# EAGLE design teensy_protocol_xl8r_3_2 (EAGLE 8.5.2)
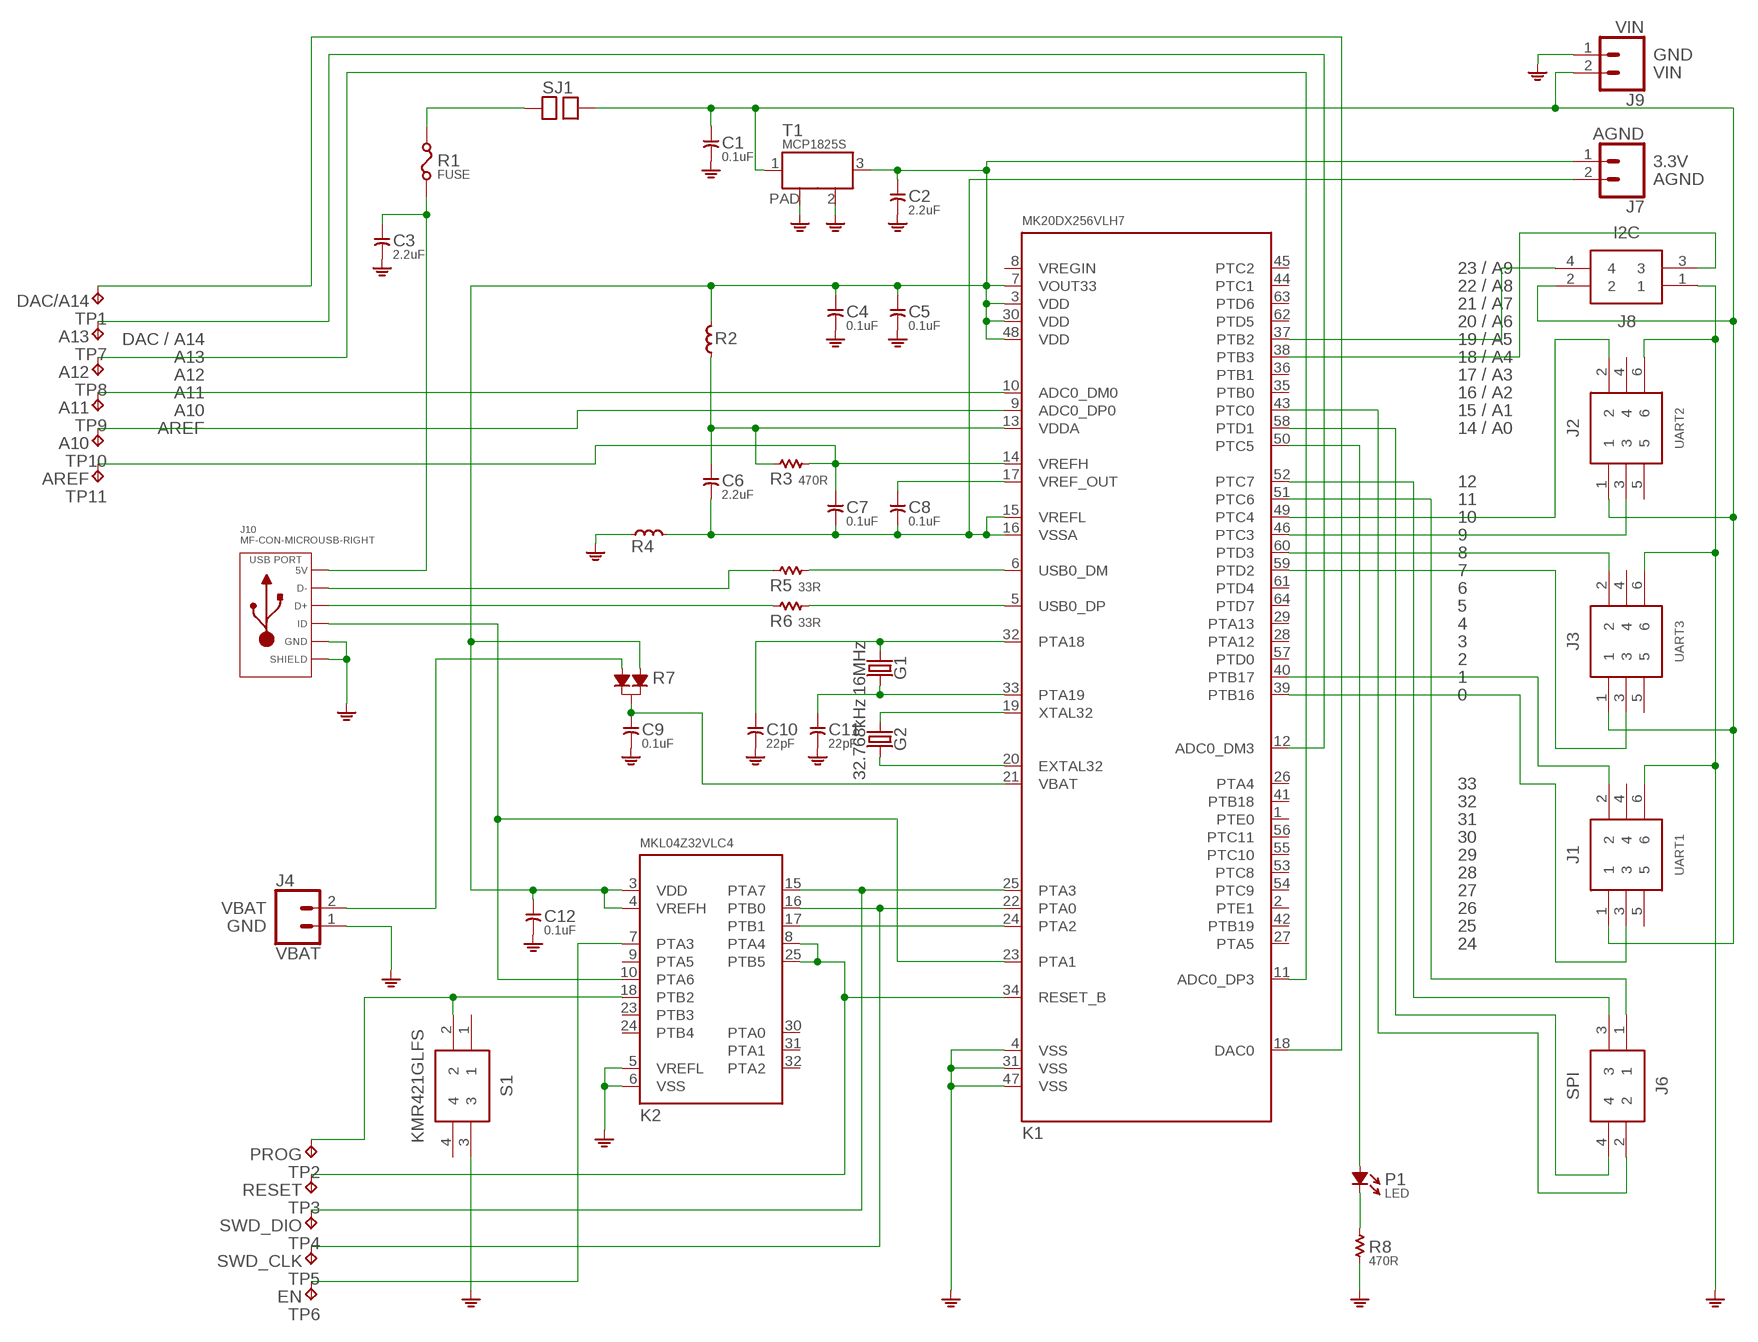
[diagram p0: schematic, sheet 1]

## Parts
C1  0.1uF  CAPACITOR-0.1UF  [C0603]
C2  2.2uF  CAPACITOR-2.2UF  [C0805]
C3  2.2uF  CAPACITOR-2.2UF  [C0805]
C4  0.1uF  CAPACITOR-0.1UF  [C0603]
C5  0.1uF  CAPACITOR-0.1UF  [C0603]
C6  2.2uF  CAPACITOR-2.2UF  [C0805]
C7  0.1uF  CAPACITOR-0.1UF  [C0603]
C8  0.1uF  CAPACITOR-0.1UF  [C0603]
C9  0.1uF  CAPACITOR-0.1UF  [C0603]
C10  22pF  CAPACITOR-22PF  [C0603]
C11  22pF  CAPACITOR-22PF  [C0603]
C12  0.1uF  CAPACITOR-0.1UF  [C0603]
G1  16MHz  CRYSTAL-16MHZSMD-5X3.2  [CRYSTAL-SMD-5X3.2-4PAD]
G2  32.768kHz  CRYSTAL-32.768KHZSMD-3.2X1.5  [CRYSTAL-SMD-3.2X1.5MM]
J1  UART1  BM06B-GHS-TBT(LF)(SN)  [BM06B-GHS-TBT]
J2  UART2  BM06B-GHS-TBT(LF)(SN)  [BM06B-GHS-TBT]
J3  UART3  BM06B-GHS-TBT(LF)(SN)  [BM06B-GHS-TBT]
J4  VBAT  CONN_02  [1X02]
J6  SPI  BM04B-GHS-TBT(LF)(SN)  [BM04B-GHS-TBT]
J7  AGND  CONN_02  [1X02]
J8  I2C  BM04B-GHS-TBT(LF)(SN)  [BM04B-GHS-TBT]
J9  VIN  CONN_02  [1X02]
J10  MF-CON-MICROUSB-RIGHT  USB_MICRO_RIGHT  [MICROUSB-RIGHT]
K1  MK20DX256VLH7  [LQFP64-05]
K2  MKL04Z32VLC4  [LQFP32-08]
P1  LED  [LED-0805]
R1  FUSE  [F0805]
R2  FERRITE  [L0603]
R3  470R  RESISTOR-470R  [R0603]
R4  FERRITE  [L0603]
R5  33R  RESISTOR-33R  [R0603]
R6  33R  RESISTOR-33R  [R0603]
R7  DIODE_DUAL  [SOT-23]
R8  470R  RESISTOR-470R  [R0603]
S1  KMR421GLFS  [KMR_2]
SJ1  VUSB  SOLDERJUMPER  [SOLDERJUMPER]
T1  MCP1825S  LDO  [SOT-223]
TP1  TPTP06R  [TP06R]
TP2  TPTP06R  [TP06R]
TP3  TPTP06R  [TP06R]
TP4  TPTP06R  [TP06R]
TP5  TPTP06R  [TP06R]
TP6  TPTP06R  [TP06R]
TP7  TPTP06R  [TP06R]
TP8  TPTP06R  [TP06R]
TP9  TPTP06R  [TP06R]
TP10  TPTP06R  [TP06R]
TP11  TPTP06R  [TP06R]

## Nets
CS: J6.2 K1.43(PTC0)
DIN: J6.3 K1.52(PTC7)
DOUT: J6.1 K1.51(PTC6)
GND [GND]: C1.2 C2.2 C3.2 C4.2 C5.2 C9.2 C10.2 C11.2 C12.2 J1.6 J2.6 J3.6 J4.1 J8.1 J9.1 J10.5(GND) J10.S1(SLD) J10.S2(SLD) J10.S3(SLD) J10.S4(SLD) J10.S5(SLD) J10.S6(SLD) K1.4(VSS) K1.31(VSS) K1.47(VSS) K2.5(VREFL) K2.6(VSS) R4.1 R8.1 S1.3 T1.2(GND) T1.PAD
N$1: K2.7(PTA3) TP6.TP
N$2: K1.22(PTA0) K2.16(PTB0) TP5.TP
N$3: K1.24(PTA2) K2.17(PTB1)
N$5: C10.1 G1.1 K1.32(PTA18)
N$6: C11.1 G1.3 K1.33(PTA19)
N$7: G2.P$1 K1.19(XTAL32)
N$8: G2.P$2 K1.20(EXTAL32)
N$9: K2.18(PTB2) S1.2 TP2.TP
N$10: K1.5(USB0_DP) R6.2
N$11: C8.1 K1.17(VREF_OUT)
N$12: K1.34(RESET_B) K2.8(PTA4) K2.25(PTB5) TP3.TP
N$13: C7.1 K1.14(VREFH) R3.2 TP11.TP
N$14: K1.6(USB0_DM) R5.2
N$15: C6.1 K1.13(VDDA) R2.1 R3.1
N$25: J8.4 K1.37(PTB2)
N$26: J8.3 K1.38(PTB3)
N$31: K1.50(PTC5) P1.+
N$34: J2.2 K1.49(PTC4)
N$35: J2.3 K1.46(PTC3)
N$36: J3.2 K1.60(PTD3)
N$37: J3.3 K1.59(PTD2)
N$43: J1.2 K1.40(PTB17)
N$44: J1.3 K1.39(PTB16)
N$45: K1.12(ADC0_DM3) TP7.TP
N$52: P1.- R8.2
N$53: C6.2 C7.2 C8.2 J7.2 K1.15(VREFL) K1.16(VSSA) R4.2
N$54: K1.18(DAC0) TP1.TP
N$55: K1.11(ADC0_DP3) TP8.TP
N$63: J4.2 R7.2
N$64: K1.10(ADC0_DM0) TP9.TP
N$65: K1.9(ADC0_DP0) TP10.TP
N$67: R1.2 SJ1.1
N$68: C9.1 K1.21(VBAT) R7.3
N$69: C2.1 C4.1 C5.1 C12.1 J7.1 K1.3(VDD) K1.7(VOUT33) K1.30(VDD) K1.48(VDD) K2.3(VDD) K2.4(VREFH) R2.2 R7.1 T1.3(OUT)
N$70: K1.25(PTA3) K2.15(PTA7) TP4.TP
SCK: J6.4 K1.58(PTD1)
USB0_DM: J10.2(D-) R5.1
USB0_DP: J10.3(D+) R6.1
USB0_ID: J10.4(ID) K1.23(PTA1) K2.10(PTA6)
VBUS: C3.1 J10.1(5V) R1.1
VIN [VIN]: C1.1 J1.1 J2.1 J3.1 J8.2 J9.2 SJ1.2 T1.1(IN)
Unconnected: J1.4 J1.5 J2.4 J2.5 J3.4 J3.5 K1.1(PTE0) K1.2(PTE1) K1.8(VREGIN) K1.26(PTA4) K1.27(PTA5) K1.28(PTA12) K1.29(PTA13) K1.35(PTB0) K1.36(PTB1) K1.41(PTB18) K1.42(PTB19) K1.44(PTC1) K1.45(PTC2) K1.53(PTC8) K1.54(PTC9) K1.55(PTC10) K1.56(PTC11) K1.57(PTD0) K1.61(PTD4) K1.62(PTD5) K1.63(PTD6) K1.64(PTD7) K2.9(PTA5) K2.23(PTB3) K2.24(PTB4) K2.30(PTA0) K2.31(PTA1) K2.32(PTA2) S1.1 S1.4

## Notes on the sheet
- GND
- VIN
- 3.3V
- AGND
- 23 / A9
- 22 / A8
- 21 / A7
- 20 / A6
- DAC / A14 | 19 / A5
- A13 | 18 / A4
- A12 | 17 / A3
- A11 | 16 / A2
- A10 | 15 / A1
- AREF | 14 / A0
- 12
- 11
- 10
- 9
- 8
- 7
- 6
- 5
- 4
- 3
- 2
- 1
- 0
- 33
- 32
- 31
- 30
- 29
- 28
- 27
- VBAT | 26
- GND | 25
- 24

## Library data of the parts
C1 C4 C5 C7-C9 C12 = t32_ref:CAPACITOR-0.1UF; DESC: 0.1uF / 16VDC / X7R; MF: Murata Electronics; MPN: GRM188R71C104KA01D; OC_MOUSER: 81-GRM39X104K16; PACKAGE: 0603; TYPE: Capacitor
C2 C3 C6 = t32_ref:CAPACITOR-2.2UF; DESC: 2.2uF / 25 VDC / X7R; MF: Taiyo Yuden; MPN: TMK212B7225KG-TR; OC_MOUSER: 963-TMK212B7225KG-TR; PACKAGE: 0805; TYPE: Capacitor
C10 C11 = t32_ref:CAPACITOR-22PF; DESC: 22pF / 50VDC / C0G (NP0); MF: Vishay / Vitramon; MPN: VJ0603A220JXACW1BC; OC_MOUSER: 77-VJ0603A220JXACBC; PACKAGE: 0603; TYPE: Capacitor
G1 = SparkFun-Clocks:CRYSTAL-16MHZ: 16MHz Crystal Digikey Example <http://www.digikey.com/product-search/en?keywords=535-9122-1-ND> Frequency: 16MHz Frequency Stability: ±50ppm Frequency Tolerance: ±20ppm Load Capacitance: 18pF SparkFun Products: Pro Micro -5V/16MHz <https://www.sparkfun.com/products/12640> SparkFun Serial Enabled LCD Kit <https://www.sparkfun.com/products/10097>; PROD_ID: XTAL-08218; SF_ID: COM-00094
G2 = SparkFun-Clocks:CRYSTAL-32.768KHZ: 32.768kHz Crystal Frequency: 32.768kHz Frequency Stability: ±20ppm Load Capacitance: 12.5pF (PTH-2X6 & SMD-3.2X1.5), 6pF (SMD-2X6) SparkFun Products: SparkFun BigTime Watch Kit <https://www.sparkfun.com/products/11734> SparkFun nRF52832 Breakout <https://www.sparkfun.com/products/13990> SparkFun Real Time Clock Module <https://www.sparkfun.com/products/12708>; PROD_ID: XTAL-13062
J1-J3 = BM06B-GHS-TBT(LF)(SN):BM06B-GHS-TBT(LF)(SN): GH 1.25mm header top entry 6 way JST GH Series, 1.25mm Pitch 6 Way Shrouded Straight PCB Header, Surface Mount, Solder Termination <https://componentsearchengine.com/Images/3/BM06B-GHS-TBT%28LF%29%28SN%29.jpg> Source: Datasheet <http://docs-europe.electrocomponents.com/webdocs/10ce/0900766b810cef17.pdf>; DESCRIPTION: GH 1.25mm header top entry 6 way JST GH Series, 1.25mm Pitch 6 Way Shrouded Straight PCB Header, Surface Mount, Solder Termination; HEIGHT: mm; MANUFACTURER_NAME: JST (JAPAN SOLDERLESS TERMINALS); MANUFACTURER_PART_NUMBER: BM06B-GHS-TBT(LF)(SN); MPN: BM06B-GHS-TBT(LF)(SN); POPULATE: 1; RS_PART_NUMBER: 7521771; SUPPLIER_NAME: RS
J4 J7 J9 = SparkFun-Connectors:CONN_02: Multi connection point. Often used as Generic Header-pin footprint for 0.1 inch spaced/style header connections On any of the 0.1 inch spaced packages, you can populate with these: Break Away Headers - Straight <https://www.sparkfun.com/products/116> (PRT-00116) Break Away Male Headers - Right Angle <https://www.sparkfun.com/products/553> (PRT-00553) Female Headers <https://www.sparkfun.com/products/115> (PRT-00115) Break Away Headers - Machine Pin <https://www.sparkfun.com/products/117> (PRT-00117) Break Away Female Headers - Swiss Machine Pin <https://www.sparkfun.com/products/743> (PRT-00743) For SCREWTERMINALS and SPRING TERMINALS visit here: Screw Terimnals on SparkFun.com <https://www.sparkfun.com/search/results?term=Screw+Terminals> (5mm/3.5mm/2.54mm spacing) This device is also useful as a general connection point to wire up your design to another part of your project. Our various solder wires solder well into these plated through hole pads. Hook-Up Wire - Assortment (Stranded, 22 AWG) <https://www.sparkfun.com/products/11375> (PRT-11375) Hook-Up Wire - Assortment (Solid Core, 22 AWG) <https://www.sparkfun.com/products/11367> (PRT-11367) View the entire wire category on our website here <https://www.sparkfun.com/categories/141> Special notes: Molex polarized connector foot print use with: PRT-08233 with associated crimp pins and housings. 2.54_SCREWTERM for use with PRT-10571. 3.5mm Screw Terminal footprints for PRT-08084 5mm Screw Terminal footprints for use with PRT-08432
J6 J8 = BM04B-GHS-TBT(LF)(SN):BM04B-GHS-TBT(LF)(SN): JST GH Series, 1.25mm Pitch 4 Way Straight PCB Header, Solder Termination, 1A <https://componentsearchengine.com/Images/3/BM04B-GHS-TBT%28LF%29%28SN%29.jpg> Source: Datasheet <http://uk.rs-online.com/web/p/products/7521769>; DESCRIPTION: JST GH Series, 1.25mm Pitch 4 Way Straight PCB Header, Solder Termination, 1A; HEIGHT: mm; MANUFACTURER_NAME: JST (JAPAN SOLDERLESS TERMINALS); MANUFACTURER_PART_NUMBER: BM04B-GHS-TBT(LF)(SN); MPN: BM04B-GHS-TBT(LF)(SN); POPULATE: 1; RS_PART_NUMBER: 7521769P; SUPPLIER_NAME: RS
J10 = MF_Connectors:USB: Library: MF_Connectors Description: 5 Pin USB Connectors. SLD is the shield connection. Usually tied to ground through a small ferrite bead.; HOUSEPART: YES; MPN: MF-CON-MICROUSB-RIGHT; POPULATE: 1; URL: https://factory.macrofab.com/part/MF-CON-MICROUSB-RIGHT
K1 = t32_ref:MK20DX256VLH7; DESC: MK20DX256VLH7; MF: NXP; MPN: MK20DX256VLH7; OC_MOUSER: 841-MK20DX256VLH7; PACKAGE: LQFP-64; TYPE: Microcontroller
K2 = t32_ref:MKL04Z32VLC4; DESC: MKL04Z32VLC4 (preprogrammed); MF: PJRC; MPN: IC_MKL04Z32_TQFP32; PACKAGE: LQFP-32; TYPE: Microcontroller
P1 = t32_ref:LED; DESC: orange; MF: ROHM Semiconductor; MPN: SML-211DTT86; OC_MOUSER: 755-SML-211DTT86; PACKAGE: 0805; TYPE: LED
R1 = t32_ref:FUSE; DESC: 6V / 0.5A; MF: Bel Fuse; MPN: 0ZCK0050FF2E; OC_MOUSER: 530-0ZCK0050FF2E; PACKAGE: 0805; TYPE: PPTC
R2 R4 = t32_ref:FERRITE; DESC: 600R / 100MHz; MF: Murata Electronics; MPN: BLM18AG601SN1D; OC_MOUSER: 81-BLM11A601S; PACKAGE: 0603; TYPE: Ferrite
R3 R8 = t32_ref:RESISTOR-470R; DESC: 470R / 1 % / 0.1 W; MF: Vishay; MPN: CRCW0603470RFKEA; OC_MOUSER: 71-CRCW0603-470-E3; PACKAGE: 0603; TYPE: Resistor
R5 R6 = t32_ref:RESISTOR-33R; DESC: 33R / 1% / 0.25 W; MF: Panasonic; MPN: ERJ-PA3F33R0V; OC_MOUSER: 667-ERJ-PA3F33R0V; PACKAGE: 0603; TYPE: Resistor
R7 = t32_ref:DIODE_DUAL; DESC: Dual Schottky, common cat; MF: NXP Semiconductors; MPN: BAT54C,215; OC_MOUSER: 771-BAT54C-T/R; PACKAGE: SOT-23; TYPE: Diode
S1 = KMR421GLFS:KMR421GLFS: C & K COMPONENTS - KMR421GLFS - SWITCH, GROUND, 2N <https://componentsearchengine.com/Images/1/KMR421GLFS.jpg> Source: Datasheet <http://www.farnell.com/datasheets/1443639.pdf>; DESCRIPTION: C & K COMPONENTS - KMR421GLFS - SWITCH, GROUND, 2N; HEIGHT: mm; MANUFACTURER_NAME: C & K COMPONENTS; MANUFACTURER_PART_NUMBER: KMR421GLFS; SUPPLIER_NAME: RS
SJ1 = t32_ref:SOLDERJUMPER
T1 = t32_ref:LDO; DESC: 3.3V 500mA; MF: Microchip Technology; MPN: MCP1825S-3302E/DB; OC_MOUSER: 579-MCP1825S-3302EDB; PACKAGE: SOT-223-3; TYPE: Voltage regulator
TP1 = testpad:TP: Test pad; TP_SIGNAL_NAME: DAC/A14
TP2 = testpad:TP: Test pad; TP_SIGNAL_NAME: PROG
TP3 = testpad:TP: Test pad; TP_SIGNAL_NAME: RESET
TP4 = testpad:TP: Test pad; TP_SIGNAL_NAME: SWD_DIO
TP5 = testpad:TP: Test pad; TP_SIGNAL_NAME: SWD_CLK
TP6 = testpad:TP: Test pad; TP_SIGNAL_NAME: EN
TP7 = testpad:TP: Test pad; TP_SIGNAL_NAME: A13
TP8 = testpad:TP: Test pad; TP_SIGNAL_NAME: A12
TP9 = testpad:TP: Test pad; TP_SIGNAL_NAME: A11
TP10 = testpad:TP: Test pad; TP_SIGNAL_NAME: A10
TP11 = testpad:TP: Test pad; TP_SIGNAL_NAME: AREF

## Net classes
0 default: width 0.202 mm
1 GND: width 0.405 mm
2 VIN: width 0.303 mm

## Board
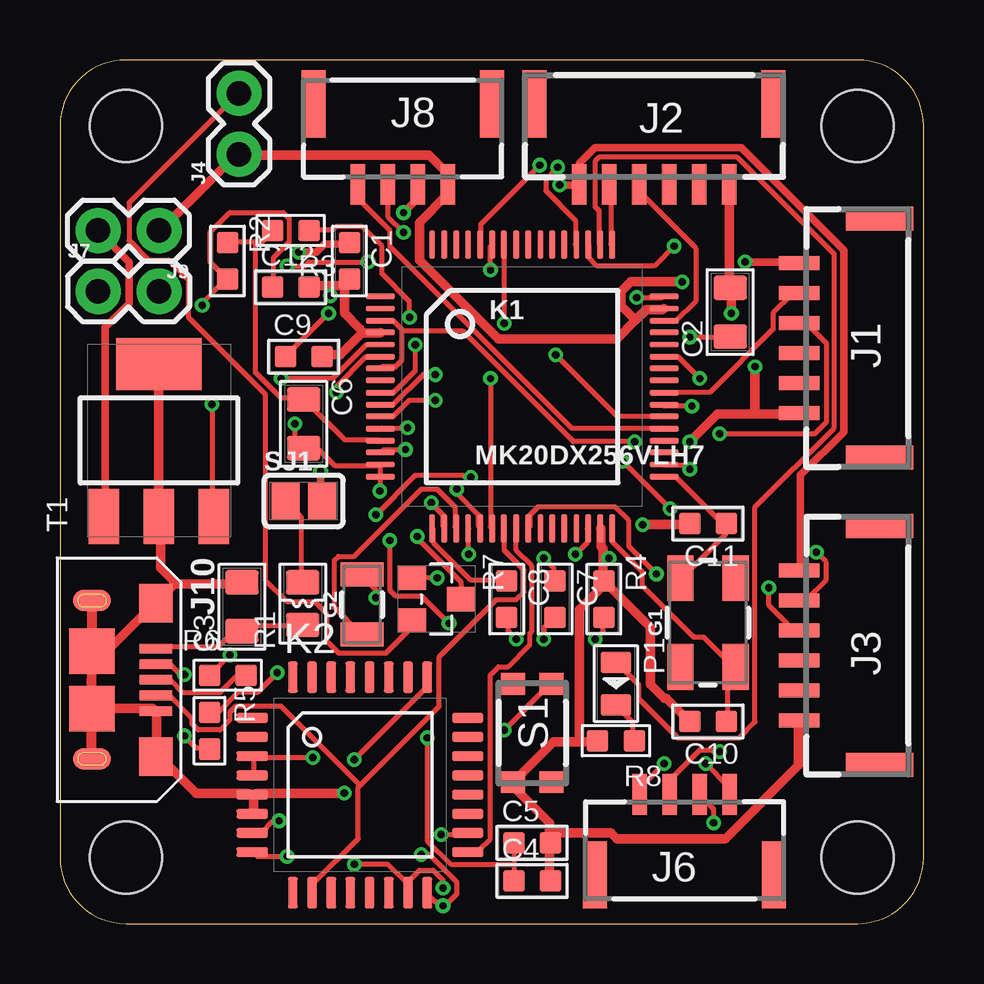
[diagram p1: board, top side]
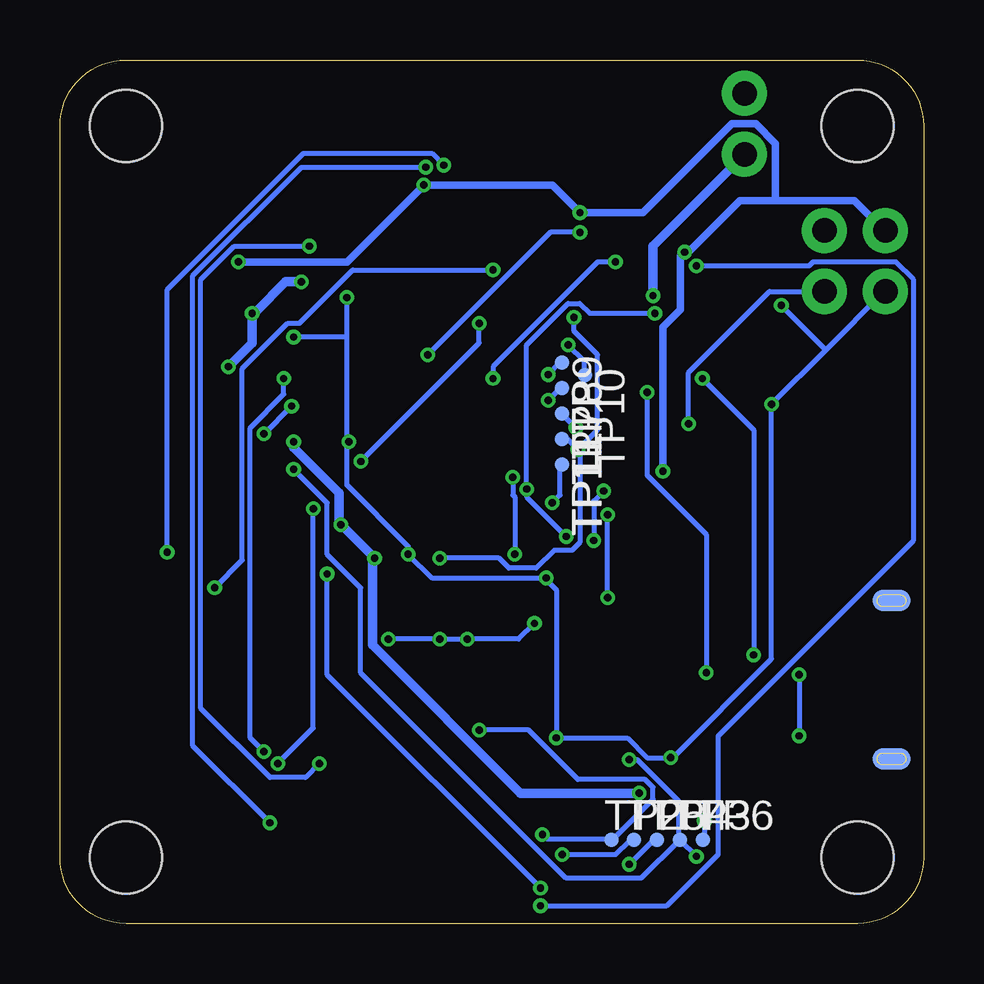
[diagram p2: board, bottom side, seen from below]

Size 36 x 36 mm. Coordinates in mm from the lower left corner, seen from the top.
Outline: 0,33.25 0,2.75 arc90 2.75,0 33.25,0 arc90 36,2.75 36,33.25 arc90 33.25,36 2.75,36 arc90 0,33.25
Copper layers (1*16): Top 0.035mm / dielectric 1.5mm / Bottom 0.035mm
Design rules "MF_Standard_2_Layer": minimum track width 5mil, minimum drill 12mil, track to track 5mil, track to pad 5mil, pad to pad 5mil, via to via 5mil, smd to smd 0mil, copper to edge 10mil, drill to drill 10mil, minimum pad ring 6mil, minimum via ring 6mil, stop-mask expansion 2mil, vias tented up to drill 25mil, thermal gap 10mil
Holes 3 mm at 2.75,2.75 2.75,33.25 33.25,33.25 33.25,2.75
tKeepout: area 0,0 to 5.2,5.2; area 0,30.8 to 5.2,36; area 30.8,30.8 to 36,36; area 30.8,0 to 36,5.2

### Footprints (pad centres in the part's own frame; a part is rotated, then mirrored left to right if it is on the bottom)
C0603 = smd 0.889 x 0.889: 1 0,0.762; 2 0,-0.762
C0805 = smd 1.397 x 1.016: 1 0,1.016; 2 0,-1.016
CRYSTAL-SMD-5X3.2-4PAD = smd 1.9 x 1.1: 1 -1.85,-1.15; 2 1.85,-1.15; 3 1.85,1.15; 4 -1.85,1.15
CRYSTAL-SMD-3.2X1.5MM = smd 1 x 1.8: P$1 -1.25,0; P$2 1.25,0
BM06B-GHS-TBT = smd 0.6 x 1.7: 1 3.125,0.3; 2 1.875,0.3; 3 0.625,0.3; 4 -0.625,0.3; 5 -1.875,0.3; 6 -3.125,0.3 | smd 1 x 2.8: 7 4.975,-3.05; 8 -4.975,-3.05
1X02 = drill 1.016 pad 1.88: 1 0,0; 2 2.54,0
BM04B-GHS-TBT = smd 0.6 x 1.7: 1 -1.875,0.3; 2 -0.625,0.3; 3 0.625,0.3; 4 1.875,0.3 | smd 1 x 2.8: 5 -3.725,-3.05; 6 3.725,-3.05
MICROUSB-RIGHT = smd 0.4 x 1.35: 1 -1.3,1.27; 2 -0.65,1.27; 3 0,1.27; 4 0.65,1.27; 5 1.3,1.27 | smd 0.9 x 1.6: S1 -3.3,-1.4; S2 3.3,-1.4 | smd 1.6 x 1.4: S3 -3.2,1.27; S4 3.2,1.27 | smd 1.9 x 1.9: S5 -1.2,-1.405; S6 1.2,-1.405 | smd 0.9 x 1.6 bottom: S7 -3.3,-1.4; S8 3.3,-1.4
LQFP64-05 = smd 1.2 x 0.25: 1 -5.915,3.759; 2 -5.915,3.251; 3 -5.915,2.743; 4 -5.915,2.261; 5 -5.915,1.753; 6 -5.915,1.245; 7 -5.915,0.762; 8 -5.915,0.254; 9 -5.915,-0.254; 10 -5.915,-0.762; 11 -5.915,-1.245; 12 -5.915,-1.753; 13 -5.915,-2.261; 14 -5.915,-2.743; 15 -5.915,-3.251; 16 -5.915,-3.759; 33 5.915,-3.759; 34 5.915,-3.251; 35 5.915,-2.743; 36 5.915,-2.261; 37 5.915,-1.753; 38 5.915,-1.245; 39 5.915,-0.762; 40 5.915,-0.254; 41 5.915,0.254; 42 5.915,0.762; 43 5.915,1.245; 44 5.915,1.753; 45 5.915,2.261; 46 5.915,2.743; 47 5.915,3.251; 48 5.915,3.759 | smd 0.25 x 1.2: 17 -3.759,-5.915; 18 -3.251,-5.915; 19 -2.743,-5.915; 20 -2.261,-5.915; 21 -1.753,-5.915; 22 -1.245,-5.915; 23 -0.762,-5.915; 24 -0.254,-5.915; 25 0.254,-5.915; 26 0.762,-5.915; 27 1.245,-5.915; 28 1.753,-5.915; 29 2.261,-5.915; 30 2.743,-5.915; 31 3.251,-5.915; 32 3.759,-5.915; 49 3.759,5.915; 50 3.251,5.915; 51 2.743,5.915; 52 2.261,5.915; 53 1.753,5.915; 54 1.245,5.915; 55 0.762,5.915; 56 0.254,5.915; 57 -0.254,5.915; 58 -0.762,5.915; 59 -1.245,5.915; 60 -1.753,5.915; 61 -2.261,5.915; 62 -2.743,5.915; 63 -3.251,5.915; 64 -3.759,5.915
LQFP32-08 = smd 1.3 x 0.4: 1 -4.493,2.8; 2 -4.493,2; 3 -4.493,1.2; 4 -4.493,0.4; 5 -4.493,-0.4; 6 -4.493,-1.2; 7 -4.493,-2; 8 -4.493,-2.8; 17 4.493,-2.8; 18 4.493,-2; 19 4.493,-1.2; 20 4.493,-0.4; 21 4.493,0.4; 22 4.493,1.2; 23 4.493,2; 24 4.493,2.8 | smd 0.4 x 1.3: 9 -2.8,-4.493; 10 -2,-4.493; 11 -1.2,-4.493; 12 -0.4,-4.493; 13 0.4,-4.493; 14 1.2,-4.493; 15 2,-4.493; 16 2.8,-4.493; 25 2.8,4.493; 26 2,4.493; 27 1.2,4.493; 28 0.4,4.493; 29 -0.4,4.493; 30 -1.2,4.493; 31 -2,4.493; 32 -2.8,4.493
LED-0805 = smd 0.889 x 1.27: + -0.889,0; - 0.889,0
F0805 = smd 1.397 x 1.016: 1 0,0.889; 2 0,-0.889
L0603 = smd 0.889 x 0.889: 1 -0.762,0; 2 0.762,0
R0603 = smd 0.889 x 0.889: 1 0,0.762; 2 0,-0.762
SOT-23 = smd 1.016 x 1.143: 1 -0.889,-1.016; 2 0.889,-1.016; 3 0,1.016
KMR_2 = smd 0.9 x 1: 1 -2.05,-0.8; 2 -2.05,0.8; 3 2.05,-0.8; 4 2.05,0.8
SOLDERJUMPER = smd 1.168 x 1.6: 1 -0.762,0; 2 0.762,0
SOT-223 = smd 1.27 x 2.286: 1 -2.286,-3.175; 2 0,-3.175; 3 2.286,-3.175 | smd 3.556 x 2.159: PAD 0,3.175
TP06R = smd 0.6 x 0.6: TP 0,0

### Placement (x,y rotation side)
C1  12.06,27.62 0 top
C2  27.94,25.49 180 top
C3  7.59,13.21 180 top
C4  19.68,1.78 90 top
C5  19.68,3.36 90 top
C6  10.16,20.83 0 top
C7  20.64,13.53 0 top
C8  18.62,13.53 0 top
C9  10.16,23.63 90 top
C10  27.02,8.42 270 top
C11  27.02,16.67 270 top
C12  9.62,26.52 90 top
G1  27.02,12.55 90 top
G2  12.59,13.3 90 top
J1  31.11,24.41 90 top
J2  24.77,31.11 180 top
J3  31.11,11.59 90 top
J4  7.46,32.07 90 top
J6  26.04,5.08 0 top
J7  1.59,26.35 0 top
J8  14.29,31.11 180 top
J9  4.13,28.89 180 top
J10  2.73,10.16 270 top
K1  19.27,22.38 0 top
K2  12.51,5.78 0 top
P1  23.18,10 270 top
R1  10.12,13.34 180 top
R2  6.99,27.62 270 top
R3  9.62,28.89 90 top
R4  22.67,13.53 270 top
R5  6.23,8.03 180 top
R6  7,10.35 270 top
R7  15.7,13.53 270 top
R8  23.18,7.62 90 top
S1  19.68,7.94 270 top
SJ1  10.16,17.61 0 top
T1  4.13,20.14 0 top
TP1  15.07,19.14 270 bottom
TP2  13.02,3.49 0 bottom
TP3  10.16,3.49 0 bottom
TP4  11.11,3.49 0 bottom
TP5  12.06,3.49 0 bottom
TP6  9.21,3.49 0 bottom
TP7  15.07,21.27 270 bottom
TP8  15.07,22.33 270 bottom
TP9  15.07,23.39 270 bottom
TP10  14.12,22.86 270 bottom
TP11  15.07,20.21 270 bottom

### Tracks (layer width: path | path; a pad name or v marks a point on that pad's centre or on a via)
CS  (via drill 0.3)
  Top 0.202: v26.67,22.72 25.77,23.63 K1.43 | v27.5,7.16 27.25,7.16 27.17,7.25 26.67,7.25 25.44,6.01 25.44,5.43 J6.2
  Bottom 0.202: v26.67,22.72 26.67,22.06 28.07,20.66 28.07,7.74 v27.5,7.16
DIN  (via drill 0.3)
  Top 0.202: v20.75,31.53 20.25,31.04 20.25,30.54 21.49,29.31 21.49,28.32 K1.52 | v27.25,4.2 27.25,4.78 26.67,5.35 J6.3
  Bottom 0.202: v20.75,31.53 25.93,31.53 30.46,27 30.46,7.41 v27.25,4.2
DOUT  (via drill 0.3)
  Top 0.202: v25.6,28.24 24.78,27.41 22.39,27.41 22.06,27.74 22.06,28.24 K1.51 | v25.19,6.67 24.2,5.68 24.2,5.43 J6.1
  Bottom 0.202: v25.6,28.24 28.73,28.24 30.13,26.84 30.13,8.97 27.25,6.09 25.77,6.09 v25.19,6.67
GND  (via drill 0.3)
  Top 0.405: 24,25.15 23.22,24.37 18.28,24.37 14.98,27.66 14.98,29.23 16.14,30.38 16.14,30.79 J8.1 16.05,30.95 16.05,31.37 15.39,32.02 7.66,32.02 J4.1 7.41,32.11 4.2,28.9 J9.1 | 24,25.15 24.45,25.6 25.11,25.6 K1.47 | 11.28,26.59 11.77,26.59 12.02,26.84 C1.2 11.86,26.43 11.86,25.44 12.51,24.78 12.6,24.61 | 11.28,26.59 10.46,26.59 C12.2 | 12.6,24.61 11.69,23.71 10.95,23.71 C9.2 | 12.6,24.61 13.34,24.61 K1.4 | v11.28,26.18 11.28,26.59 | K2.6 8.07,4.61 8.07,5.35 K2.5 | K2.5 7.82,5.43 5.68,5.43 4.2,6.92 J10.S4 4.03,7 4.03,8.81 J10.5 3.87,8.97 1.48,8.97 J10.S6 1.32,8.97 1.32,10.16 1.32,11.28 J10.S5 1.48,11.44 2.06,11.44 3.87,13.25 J10.S3 4.03,13.42 4.78,14.16 | 4.78,14.16 7.57,14.16 C3.2 | 4.78,14.16 4.69,14.32 4.2,14.82 4.2,16.96 T1.2 4.12,17.12 4.12,23.3 T1.PAD | C4.2 20.42,1.81 20.42,3.29 C5.2 | 21.65,7.57 20.58,7.57 18.93,5.93 S1.3 18.93,5.68 20.42,4.2 20.42,3.54 C5.2 | 21.65,7.57 22.39,7.57 R8.1 | J3.6 30.79,8.4 30.79,6.59 27.74,3.54 23.22,3.54 22.97,3.79 20.58,3.79 C5.2 | J2.6 27.91,30.79 27.91,26.51 C2.2 27.99,26.34 v27.99,25.44 | 22.64,15.23 22.64,15.64 22.56,15.72 22.56,16.46 K1.31 | 22.64,15.23 22.64,14.32 R4.1 | C10.2 26.18,8.48 25.27,9.38 25.19,9.38 24.61,9.96 24.61,12.35 22.8,14.16 R4.1 | v24.29,16.63 26.18,16.63 C11.2 | v22.89,15.23 22.64,15.23 | 28.98,21.24 27.41,21.24 v26.26,20.09 | 28.98,21.24 30.79,21.24 J1.6 | 28.98,21.24 v28.98,23.22 | 21.65,7.57 21.65,13.09 22.64,14.08 R4.1 | v11.86,5.43 8.23,5.43 K2.5 | 24,25.15 23.38,25.77 23.38,26.34 23.79,26.76 v25.93,26.76
  Top 0.406: J10.S1 1.32,13.44 1.32,11.28 | J10.S2 1.32,6.88 1.32,10.16
  Bottom 0.405: v11.28,26.18 11.28,28.24 7.49,32.02 J4.1 | v26.26,20.09 26.26,19.84 24.37,17.95 24.37,16.79 v24.29,16.63 v22.89,15.23 22.97,15.06 22.97,11.61 16.79,5.43 v11.86,5.43 | v28.98,23.22 27.99,24.2 v27.99,25.44 27.83,25.52 26.59,26.76 v25.93,26.76
N$1  (via drill 0.3)
  Top 0.202: v9.14,4.28 8.89,4.28 8.4,3.79 8.07,3.79 K2.7
  Bottom 0.202: v9.14,4.28 9.14,3.54 TP6.TP
N$2  (via drill 0.3)
  Top 0.202: v15.06,2.88 15.39,2.88 16.55,1.73 16.55,1.24 16.22,0.91 15.97,0.91 | 15.97,0.91 15.64,0.91 15.31,1.24 K2.16 | v17.95,22.72 17.95,16.55 K1.22 | v12.84,27.58 10.37,27.58 10.21,27.41 v9.47,27.41 | v15.97,0.74 15.97,0.91
  Bottom 0.202: v15.06,2.88 12.84,2.88 12.27,3.46 12.1,3.46 TP5.TP | v17.95,22.72 17.95,23.22 13.58,27.58 v12.84,27.58 | v9.47,27.41 4.78,27.41 4.61,27.58 1.15,27.58 0.41,26.84 0.41,15.97 8.56,7.82 8.56,2.88 10.7,0.74 v15.97,0.74
N$3
  Top 0.202: K1.24 19.02,15.56 19.68,14.9 19.68,12.18 19.59,12.1 19.59,11.61 18.69,10.7 18.28,10.7 17.95,10.37 17.95,3.54 17.45,3.05 17.04,3.05 K2.17
N$5
  Top 0.202: C10.1 27.83,8.48 27.83,10.29 28.16,10.62 G1.1 28.07,10.7 26.84,11.94 26.43,11.94 24.29,14.08 24.29,14.65 23.05,15.89 23.05,16.46 K1.32
N$6
  Top 0.202: G1.3 25.93,14.41 27.74,16.22 27.74,16.63 C11.1 27.66,16.63 25.68,18.61 25.19,18.61 K1.33
N$7
  Top 0.202: K1.19 16.46,16.55 16.46,17.37 15.72,18.11 15.06,18.11 12.27,15.31 11.61,15.31 11.44,15.15 11.44,13.17 12.51,12.1 G2.P$1
N$8  (via drill 0.3)
  Top 0.202: v17.04,15.39 17.04,16.46 K1.20 | v17.12,18.61 16.88,18.61 16.79,18.69 14.82,18.69 v13.17,17.04 | v13.17,13.58 13.17,13.91 12.6,14.49 G2.P$2
  Bottom 0.202: v17.04,15.39 17.04,17.78 17.12,17.86 v17.12,18.61 | v13.17,13.58 v13.17,17.04
N$9  (via drill 0.3)
  Top 0.202: v15.89,3.71 16.96,3.71 K2.18 | v18.52,8.07 20.42,9.96 S1.2
  Bottom 0.202: v15.89,3.71 15.72,3.54 13.09,3.54 TP2.TP 12.93,3.54 11.28,5.19 11.28,5.68 11.61,6.01 14.41,6.01 16.46,8.07 v18.52,8.07
N$10  (via drill 0.3)
  Top 0.202: v7.08,11.2 6.26,10.37 R6.2 | v9.22,22.72 11.36,22.72 12.76,24.12 13.34,24.12 K1.5
  Bottom 0.202: v7.08,11.2 7.08,20.58 v9.22,22.72
N$11
  Top 0.202: C8.1 18.61,14.32 17.12,14.32 15.56,15.89 15.56,16.46 K1.17
N$12  (via drill 0.3)
  Top 0.202: v9.47,2.8 8.23,2.8 8.07,2.96 K2.8 | v26.26,18.93 26.1,19.1 25.19,19.1 K1.34 | v12.27,6.83 15.23,9.8 15.23,10.21 K2.25
  Bottom 0.202: v9.47,2.8 10.13,3.46 TP3.TP | v26.26,18.93 24.86,17.54 24.86,15.39 23.46,13.99 23.46,10.46 14.9,1.89 11.77,1.89 10.21,3.46 TP3.TP | v12.27,6.83 11.94,6.83 10.21,5.1 10.21,3.54 TP3.TP
N$13  (via drill 0.3)
  Top 0.202: v14.41,19.76 13.5,19.76 13.42,19.68 K1.14 | v20.17,15.23 20.58,14.82 20.58,14.32 C7.1 | v14.57,25.27 14.57,25.93 13.42,27.09 13.42,28.24 12.6,29.06 11.53,29.06 11.36,28.9 10.46,28.9 R3.2
  Bottom 0.202: v14.41,19.76 14.82,20.17 15.06,20.17 TP11.TP | v20.17,15.23 17.7,15.23 17.29,14.82 16.14,14.82 15.39,15.56 14.65,15.56 14.32,15.89 14.32,19.76 v14.41,19.76 | v14.57,25.27 14.57,24.7 13.58,23.71 13.58,20.58 v14.41,19.76
N$14  (via drill 0.3)
  Top 0.202: v9.06,10.46 8.23,9.63 7.41,9.63 6.59,8.81 6.26,8.81 R5.2 | v11.53,22.14 11.53,22.39 12.76,23.63 13.34,23.63 K1.6
  Bottom 0.202: v9.06,10.46 9.06,16.22 11.53,18.69 v11.53,22.14
N$15
  Top 0.202: 8.15,28.4 8.4,28.4 8.81,28.81 R3.1 | 8.15,28.4 7,28.4 R2.1 | K1.13 13.34,20.17 11.86,20.17 10.21,21.82 C6.1 10.13,21.9 9.22,21.9 8.15,22.97 8.15,28.4
N$25
  Top 0.202: K1.37 25.11,20.66 21.32,20.66 13.75,28.24 13.75,28.9 12.43,30.21 12.43,30.79 J8.4
N$26  (via drill 0.3)
  Top 0.202: v20.66,23.71 23.22,21.16 25.11,21.16 K1.38 | v14.32,28.81 13.67,29.47 13.67,30.79 J8.3
  Bottom 0.202: v20.66,23.71 15.56,28.81 v14.32,28.81
N$31
  Top 0.202: K1.50 22.48,28.32 22.48,29.72 22.31,29.88 22.31,31.78 22.48,31.94 28.24,31.94 32.27,27.91 32.27,20.66 28.98,17.37 28.98,8.4 28.32,7.74 25.77,7.74 24.12,9.38 24.12,9.96 23.22,10.87 P1.+
N$34
  Top 0.202: K1.49 22.97,28.32 22.97,30.79 J2.2
N$35
  Top 0.202: K1.46 25.19,25.11 25.68,25.11 26.51,25.93 26.51,28.16 24.2,30.46 24.2,30.79 J2.3
N$36  (via drill 0.3)
  Top 0.202: v20,31.61 17.54,29.14 17.54,28.32 K1.60 | v31.53,15.48 31.94,15.06 31.94,14.32 31.12,13.5 30.87,13.5 J3.2
  Bottom 0.202: v20,31.61 20.5,32.11 25.85,32.11 31.53,26.43 v31.53,15.48
N$37  (via drill 0.3)
  Top 0.202: v17.95,27.25 17.95,28.24 K1.59 | v29.55,13.99 29.55,13.25 30.54,12.27 30.79,12.27 J3.3
  Bottom 0.202: v17.95,27.25 23.79,27.25 26.02,25.03 26.51,25.03 28.4,23.13 28.4,15.15 v29.55,13.99
N$43
  Top 0.202: K1.40 25.19,22.14 27.09,22.14 29.72,24.78 29.72,25.44 30.54,26.26 30.79,26.26 J1.2
N$44  (via drill 0.3)
  Top 0.202: v26.34,21.57 25.19,21.57 K1.39 | v27.5,20.42 31.45,20.42 31.94,20.91 31.94,24.2 31.12,25.03 30.87,25.03 J1.3
  Bottom 0.202: v27.5,20.42 v26.34,21.57
N$45  (via drill 0.3)
  Top 0.202: v14.49,20.66 13.42,20.66 K1.12
  Bottom 0.202: v14.49,20.66 15.06,21.24 TP7.TP
N$52
  Top 0.202: R8.2 23.87,7.66 23.87,8.4 23.22,9.06 P1.-
N$53  (via drill 0.3)
  Top 0.202: v19.02,11.86 18.69,12.18 18.69,12.76 C8.2 | v20.17,11.86 20.17,12.35 20.58,12.76 C7.2 | v22.31,11.86 22.64,12.18 22.64,12.76 R4.2 | v16.22,12.51 15.06,13.67 13.99,13.67 13.75,13.91 v13.75,15.97 | v13.34,18.03 13.34,18.52 K1.16 13.34,18.69 13.34,19.1 K1.15 13.25,19.1 11.44,19.1 10.79,19.76 10.21,19.76 C6.2 10.13,19.84 9.8,20.17 v9.8,20.83
  Bottom 0.202: v22.31,11.86 v20.17,11.86 v19.02,11.86 16.88,11.86 v16.22,12.51 | v13.75,15.97 13.75,17.62 v13.34,18.03 | v9.8,20.83 9.8,22.97 6.42,26.34 4.2,26.34 J7.2
N$54  (via drill 0.3)
  Top 0.202: v15.48,17.54 15.97,17.04 15.97,16.55 K1.18
  Bottom 0.202: v15.48,17.54 15.15,17.86 15.15,19.1 TP1.TP
N$55  (via drill 0.3)
  Top 0.202: v15.64,21.82 14.57,21.82 13.91,21.16 13.42,21.16 K1.11
  Bottom 0.202: v15.64,21.82 15.15,22.31 TP8.TP
N$63
  Top 0.202: R7.2 14.65,12.6 14.65,12.35 13.58,11.28 11.61,11.28 11.11,11.77 11.11,12.93 10.62,13.42 9.47,13.42 8.56,14.32 8.56,22.06 5.35,25.27 5.35,26.84 4.53,27.66 3.71,27.66 2.88,28.48 2.88,30.05 7.41,34.58 J4.2
N$64  (via drill 0.3)
  Top 0.202: v15.64,22.89 15.15,22.89 13.91,21.65 13.42,21.65 K1.10
  Bottom 0.202: v15.64,22.89 15.15,23.38 TP9.TP
N$65  (via drill 0.3)
  Top 0.202: v14.82,24.12 14.82,23.05 13.91,22.14 13.42,22.14 K1.9
  Bottom 0.202: v14.82,24.12 14.16,23.46 14.16,22.89 TP10.TP
N$67
  Top 0.202: R1.2 10.04,14.24 10.04,16.96 9.47,17.54 SJ1.1
N$68  (via drill 0.3)
  Top 0.202: v11.2,25.44 9.47,23.71 C9.1 | v16.55,18.11 16.55,17.95 17.45,17.04 17.45,16.55 K1.21 | v14.9,16.14 14.9,16.05 16.71,14.24 16.71,13.58 R7.3
  Bottom 0.202: v11.2,25.44 13.91,25.44 14.32,25.85 14.82,25.85 16.55,24.12 v16.55,18.11 16.55,17.78 v14.9,16.14
N$69  (via drill 0.3)
  Top 0.202: C12.1 8.89,26.59 8.89,27.74 9.55,28.4 9.55,29.39 9.3,29.64 7.08,29.64 6.26,28.81 6.26,27.58 6.92,26.92 R2.2 6.92,26.84 5.93,25.85 v5.93,25.77 | v6.34,21.65 6.34,17.04 T1.3 | 14.24,24.7 14.24,24.78 13.91,25.11 13.42,25.11 K1.3 | 14.24,24.7 14.24,23.46 13.99,23.22 13.42,23.22 K1.7 | K2.4 8.07,6.26 8.07,6.92 K2.3 8.15,6.92 v10.54,6.92 | 18.93,2.47 18.93,3.29 C5.1 | 18.93,2.47 18.93,1.81 C4.1 | v15.72,14.41 14.74,14.41 R7.1 | v21.49,15.39 21.98,15.89 21.98,16.46 K1.30 | v24.04,26.1 25.11,26.1 K1.48 | v26.26,24.45 27.91,24.45 C2.1 | 18.93,2.47 16.3,2.47 15.31,3.46 v15.31,7.74 | 14.24,24.7 16.79,24.7 21.4,20.09 v23.96,20.09
  Bottom 0.202: 4.08,23.91 1.65,26.34 J7.1 | 4.08,23.91 v6.34,21.65 6.34,11.03 10.46,6.92 v10.54,6.92 11.53,6.92 12.35,7.74 v15.31,7.74 15.31,13.91 15.72,14.32 v15.72,14.41 20.5,14.41 v21.49,15.39 21.49,15.72 24.04,18.28 24.04,20.09 | 4.08,23.91 v5.93,25.77 | 24.04,20.09 24.04,24.45 | 24.04,24.45 v24.04,26.1 | 24.04,24.45 v26.26,24.45 | v23.96,20.09 24.04,20.09
N$70  (via drill 0.3)
  Top 0.202: v12.27,2.47 13.67,2.47 14.49,1.65 14.49,1.32 K2.15 14.49,1.73 14.98,2.22 15.56,2.22 15.97,1.81 v15.97,1.48 | v24.86,14.57 23.71,15.72 23.71,16.79 23.13,17.37 19.92,17.37 19.59,17.04 19.59,16.55 K1.25
  Bottom 0.202: v12.27,2.47 11.28,3.46 11.11,3.46 TP4.TP | v24.86,14.57 24.86,10.37 v15.97,1.48
SCK  (via drill 0.3)
  Top 0.202: v18.52,25.03 18.52,28.24 K1.58 | v25.44,17.29 v23.46,19.26 | v26.92,6.67 27.91,5.68 27.91,5.43 J6.4
  Bottom 0.202: v18.52,25.03 18.52,24.2 v23.46,19.26 | v25.44,17.29 25.44,8.15 v26.92,6.67
USB0_DM  (via drill 0.3)
  Top 0.202: v5.19,7.82 5.68,7.33 6.17,7.33 R5.1 | v5.19,10.37 5.02,10.37 4.61,10.79 4.03,10.79 J10.2
  Bottom 0.202: v5.19,10.37 v5.19,7.82
USB0_DP
  Top 0.202: R6.1 7.74,10.29 7.33,10.29 6.67,9.63 5.1,9.63 4.61,10.13 4.03,10.13 J10.3
USB0_ID
  Top 0.202: 12.51,5.76 12.43,5.68 12.43,3.54 10.54,1.65 10.54,1.32 K2.10 | 12.51,5.76 15.81,9.06 15.81,11.11 18.19,13.5 19.02,13.5 19.35,13.83 19.35,14.74 18.52,15.56 18.52,16.46 K1.23 | 12.51,5.76 9.22,9.06 7.33,9.06 7.08,8.81 7.08,8.48 6.67,8.07 5.76,8.07 5.52,8.31 5.52,8.56 4.61,9.47 4.03,9.47 J10.4
VBUS
  Top 0.202: J10.1 4.03,11.53 6.59,11.53 7.25,12.18 7.57,12.18 C3.1 7.66,12.27 7.82,12.43 10.04,12.43 R1.1
VIN  (via drill 0.3)
  Top 0.303: v9.96,27.99 10.7,27.99 11.03,28.32 12.02,28.32 C1.1 | v10.87,18.85 10.87,17.62 SJ1.2 | v14.32,29.64 14.9,30.21 14.9,30.79 J8.2 | v20.83,30.79 21.57,30.79 J2.1 21.65,30.95 21.65,31.7 22.31,32.35 28.4,32.35 32.68,28.07 32.68,20.5 30.87,18.69 30.87,14.74 J3.1 | v28.57,27.58 30.79,27.58 J1.1 | T1.1 1.89,17.04 1.89,24.86 2.88,25.85 2.88,27.58 1.65,28.81 J9.2
  Bottom 0.303: 6.17,30.13 2.88,30.13 1.65,28.9 J9.2 | 6.17,30.13 7.66,30.13 9.8,27.99 v9.96,27.99 10.13,27.83 10.13,25.6 10.87,24.86 v10.87,18.85 | 6.17,30.13 6.17,32.52 7,33.34 7.99,33.34 11.69,29.64 v14.32,29.64 15.48,30.79 v20.83,30.79 24.04,27.58 v28.57,27.58